# Altium schematic sheet MapaSensorChassi002.SchDoc
size A4
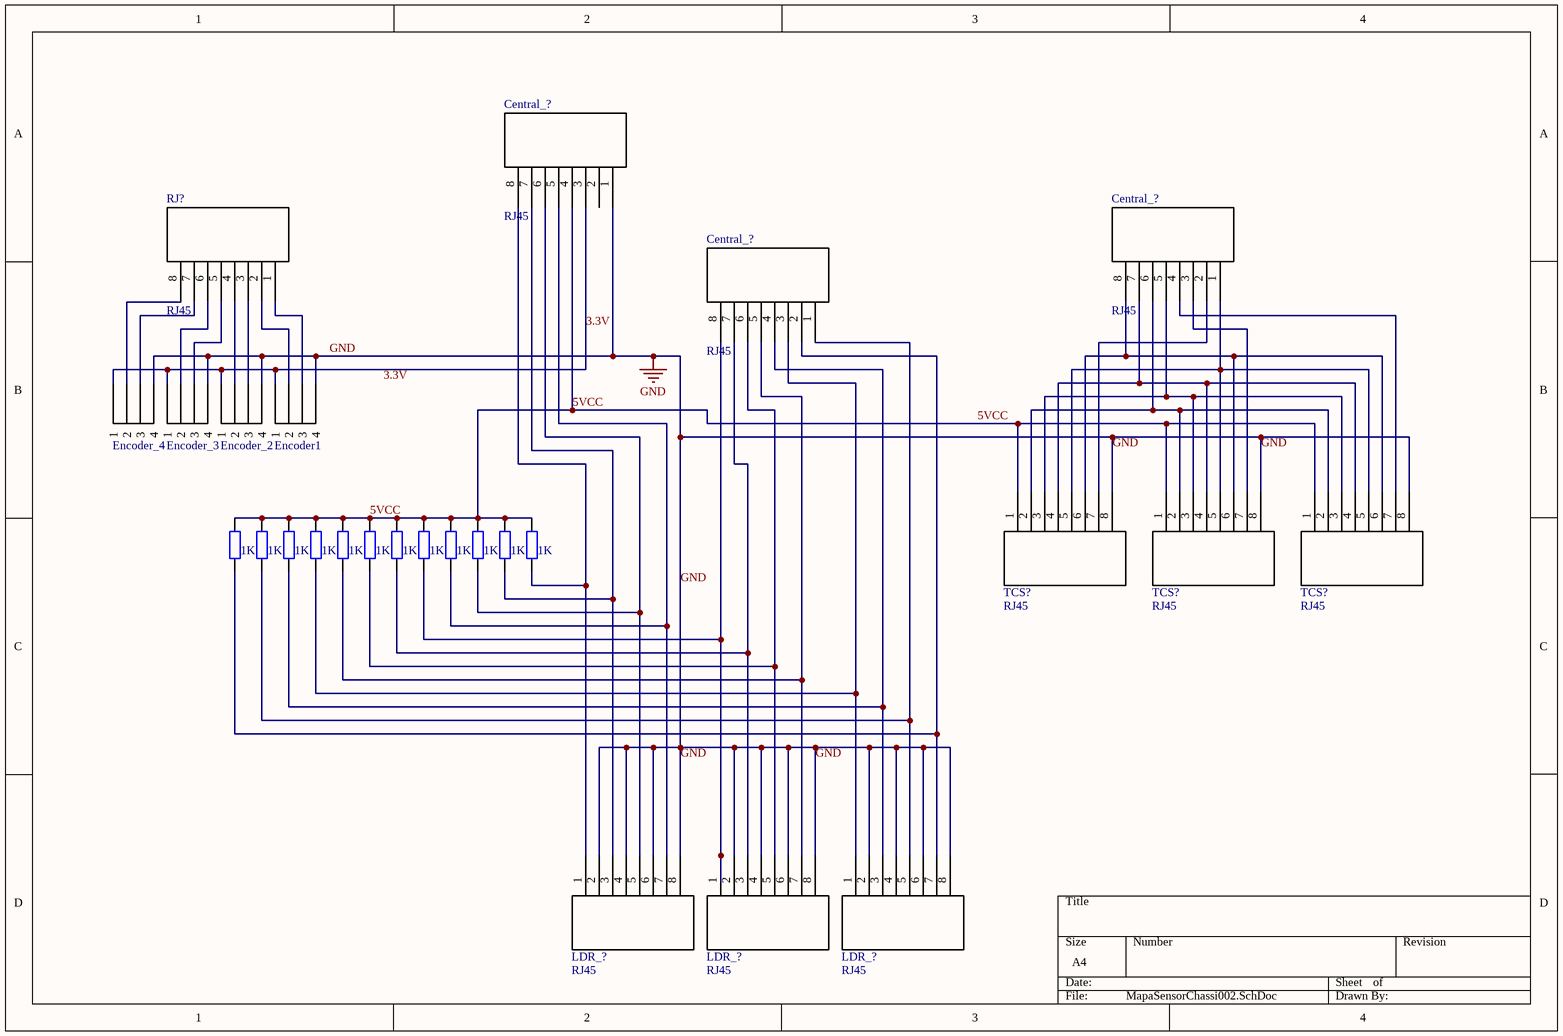
[diagram p0: MapaSensorChassi002.SchDoc]

## Parts
(Parts that share a designator on the sheet are numbered #1, #2 ... from top to bottom, then left to right.)
Central_?#1  RJ45  [RJ45_90]
Central_?#2  RJ45  [RJ45_90]
Central_?#3  RJ45  [RJ45_90]
Encoder_?#1  Encoder_3  [4-vias]
Encoder_?#2  Encoder_2  [4-vias]
Encoder_?#3  Encoder1  [4-vias]
K?  Encoder_4  [4-vias]
LDR_?#1  RJ45  [RJ45_Simples]
LDR_?#2  RJ45  [RJ45_Simples]
LDR_?#3  RJ45  [RJ45_Simples]
R?#1  value 1K  [AXIAL-0.4]  (hidden comment: Res2)
R?#2  value 1K  [AXIAL-0.4]  (hidden comment: Res2)
R?#3  value 1K  [AXIAL-0.4]  (hidden comment: Res2)
R?#4  value 1K  [AXIAL-0.4]  (hidden comment: Res2)
R?#5  value 1K  [AXIAL-0.4]  (hidden comment: Res2)
R?#6  value 1K  [AXIAL-0.4]  (hidden comment: Res2)
R?#7  value 1K  [AXIAL-0.4]  (hidden comment: Res2)
R?#8  value 1K  [AXIAL-0.4]  (hidden comment: Res2)
R?#9  value 1K  [AXIAL-0.4]  (hidden comment: Res2)
R?#10  value 1K  [AXIAL-0.4]  (hidden comment: Res2)
R?#11  value 1K  [AXIAL-0.4]  (hidden comment: Res2)
R?#12  value 1K  [AXIAL-0.4]  (hidden comment: Res2)
RJ?  RJ45  [RJ45_90]
TCS?#1  RJ45  [RJ45_Simples]
TCS?#2  RJ45  [RJ45_90]
TCS?#3  RJ45  [RJ45_90]

## Nets
GND: Central_?#1.1 Encoder_?#1.4 Encoder_?#2.4 Encoder_?#3.4 K?.4 LDR_?#1.2 LDR_?#1.4 LDR_?#1.6 LDR_?#1.8 LDR_?#2.2 LDR_?#2.4 LDR_?#2.6 LDR_?#2.8 LDR_?#3.2 LDR_?#3.4 LDR_?#3.6 LDR_?#3.8 TCS?#1.8 TCS?#2.8 TCS?#3.8
3.3V: Central_?#1.3 Encoder_?#1.1 Encoder_?#2.1 Encoder_?#3.1 K?.1
5VCC: Central_?#1.4 R?#1.2 R?#2.2 R?#3.2 R?#4.2 R?#5.2 R?#6.2 R?#7.2 R?#8.2 R?#9.2 R?#10.2 R?#11.2 R?#12.2 TCS?#1.1 TCS?#2.1 TCS?#3.1
NetCentral_?#1_5: Central_?#1.5 LDR_?#1.7 R?#9.1
NetCentral_?#1_6: Central_?#1.6 LDR_?#1.5 R?#10.1
NetCentral_?#1_7: Central_?#1.7 LDR_?#1.3 R?#11.1
NetCentral_?#1_8: Central_?#1.8 LDR_?#1.1 R?#12.1
NetCentral_?#2_1: Central_?#2.1 TCS?#1.5 TCS?#2.5 TCS?#3.5
NetCentral_?#2_2: Central_?#2.2 TCS?#1.7
NetCentral_?#2_3: Central_?#2.3 TCS?#2.7
NetCentral_?#2_4: Central_?#2.4 TCS?#3.7
NetCentral_?#2_5: Central_?#2.5 TCS?#1.3 TCS?#2.3 TCS?#3.3
NetCentral_?#2_6: Central_?#2.6 TCS?#1.2 TCS?#2.2 TCS?#3.2
NetCentral_?#2_7: Central_?#2.7 TCS?#1.4 TCS?#2.4 TCS?#3.4
NetCentral_?#2_8: Central_?#2.8 TCS?#1.6 TCS?#2.6 TCS?#3.6
NetCentral_?#3_1: Central_?#3.1 LDR_?#3.5 R?#2.1
NetCentral_?#3_2: Central_?#3.2 LDR_?#3.7 R?#1.1
NetCentral_?#3_3: Central_?#3.3 LDR_?#3.1 R?#4.1
NetCentral_?#3_4: Central_?#3.4 LDR_?#3.3 R?#3.1
NetCentral_?#3_5: Central_?#3.5 LDR_?#2.7 R?#5.1
NetCentral_?#3_6: Central_?#3.6 LDR_?#2.5 R?#6.1
NetCentral_?#3_7: Central_?#3.7 LDR_?#2.3 R?#7.1
NetCentral_?#3_8: Central_?#3.8 LDR_?#2.1 R?#8.1
NetEncoder_?#1_2: Encoder_?#1.2 RJ?.6
NetEncoder_?#1_3: Encoder_?#1.3 RJ?.5
NetEncoder_?#2_2: Encoder_?#2.2 RJ?.4
NetEncoder_?#2_3: Encoder_?#2.3 RJ?.3
NetEncoder_?#3_2: Encoder_?#3.2 RJ?.2
NetEncoder_?#3_3: Encoder_?#3.3 RJ?.1
NetK?_2: K?.2 RJ?.8
NetK?_3: K?.3 RJ?.7

Not connected (* = marked no-connect by the designer): Central_?#1 2

## Notes on the sheet
- Labels drawn without touching a wire or pin: 3.3V

## Library data of the parts
Encoder_?#1-Encoder_?#3 K? = KK4Vias: ComponentLink1Description: Fabricante; ComponentLink1URL: https://www.molex.com/molex/products/family?key=kk_254_rpc_connector_system&channel=products&chanName=family&pageTitle=Introduction&parentKey=kk_interconnect_solutions
R?#1-R?#12 = Res2: Resistor; Published: 8-Jun-2000; LatestRevisionDate: 17-Jul-2002; LatestRevisionNote: Re-released for DXP Platform.; PackageReference: AXIAL-0.4; Publisher: Altium Limited; PackageDescription: Axial Device, Thru-Hole; 2 Leads; 0.4 in Pin Spacing